# Altium schematic sheet M7_DSP_MCU_Power.SchDoc
size A3; SheetNumber: 2; SheetTotal: 5
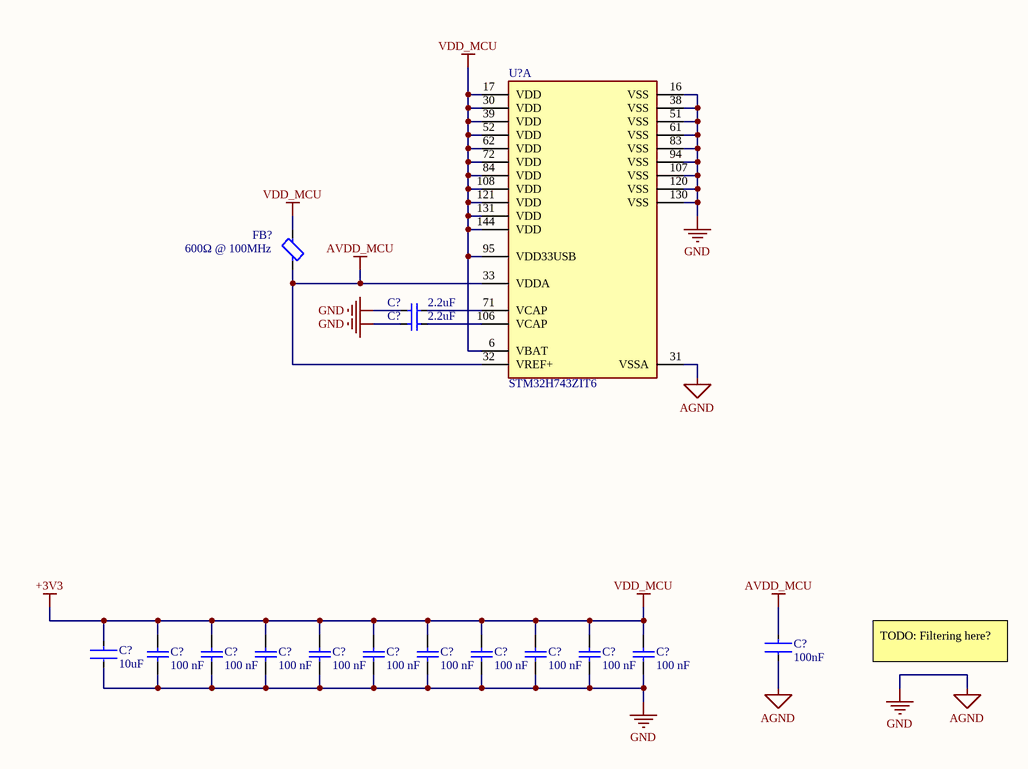
[diagram p0: M7_DSP_MCU_Power.SchDoc]

## Parts
(Parts that share a designator on the sheet are numbered #1, #2 ... from top to bottom, then left to right.)
C?#1  Capacitance: 2.2uF  [FP-CL10-IPC_A]  (hidden comment: CL10A225KO8NNNC)
C?#2  Capacitance: 2.2uF  [FP-CL10-IPC_A]  (hidden comment: CL10A225KO8NNNC)
C?#3  Capacitance: 100 nF  [CAPC1608X90X40ML10T20]  (hidden comment: CC0603ZRY5V9BB104)
C?#4  Capacitance: 100 nF  [CAPC1608X90X40ML10T20]  (hidden comment: CC0603ZRY5V9BB104)
C?#5  Capacitance: 100 nF  [CAPC1608X90X40ML10T20]  (hidden comment: CC0603ZRY5V9BB104)
C?#6  Capacitance: 100 nF  [CAPC1608X90X40ML10T20]  (hidden comment: CC0603ZRY5V9BB104)
C?#7  Capacitance: 100 nF  [CAPC1608X90X40ML10T20]  (hidden comment: CC0603ZRY5V9BB104)
C?#8  Capacitance: 100 nF  [CAPC1608X90X40ML10T20]  (hidden comment: CC0603ZRY5V9BB104)
C?#9  Capacitance: 100 nF  [CAPC1608X90X40ML10T20]  (hidden comment: CC0603ZRY5V9BB104)
C?#10  Capacitance: 100 nF  [CAPC1608X90X40ML10T20]  (hidden comment: CC0603ZRY5V9BB104)
C?#11  Capacitance: 100 nF  [CAPC1608X90X40ML10T20]  (hidden comment: CC0603ZRY5V9BB104)
C?#12  Capacitance: 100 nF  [CAPC1608X90X40ML10T20]  (hidden comment: CC0603ZRY5V9BB104)
C?#13  Capacitance: 100nF  [FP-0402-L_1_0_0_05-W_0_5-MFG]  (hidden comment: TMK105B7104MV-FR)
C?#14  value 10uF  [FP-GRM21B-0_2-e0_2_0_7-MFG]  (hidden comment: GRM21BC71E106ME11L)
FB?  MMZ1608B601CTAH0  [FP-MMZ1608-0_6-IPC_C]  (value not drawn)
U?  STM32H743ZIT6  [FP-LQFP144-1A-IPC_A]  (part A of 3)

## Nets
+3V3: C?#3.1 C?#4.1 C?#5.1 C?#6.1 C?#7.1 C?#8.1 C?#9.1 C?#10.1 C?#11.1 C?#12.1 C?#14.1 FB?.1 U?.6(VBAT) U?.17(VDD) U?.30(VDD) U?.39(VDD) U?.52(VDD) U?.62(VDD) U?.72(VDD) U?.84(VDD) U?.95(VDD33USB) U?.108(VDD) U?.121(VDD) U?.131(VDD) U?.144(VDD)  [also labelled VDD_MCU]
AGND: C?#1.2 C?#2.2 C?#3.2 C?#4.2 C?#5.2 C?#6.2 C?#7.2 C?#8.2 C?#9.2 C?#10.2 C?#11.2 C?#12.2 C?#13.2 C?#14.2 U?.16(VSS) U?.31(VSSA) U?.38(VSS) U?.51(VSS) U?.61(VSS) U?.83(VSS) U?.94(VSS) U?.107(VSS) U?.120(VSS) U?.130(VSS)  [also labelled GND]
AVDD_MCU: C?#13.1 FB?.2 U?.32(VREF+) U?.33(VDDA)
NetC?#1_1: C?#1.1 U?.71(VCAP)
NetC?#2_1: C?#2.1 U?.106(VCAP)

## Notes on the sheet
- (near FB?) 600Ω @ 100MHz
- TODO: Filtering here?

## Library data of the parts
C?#1 C?#2 = CMP-13271-000835-1: Cap Ceramic 2.2uF 16V X5R ±10% Pad SMD 0603 +85°C T/R; Case Code (Metric): 1608; Height: 0.8mm; Case/Package: 0603; Depth: 0.8mm; Voltage Rating: 16V; Case Code (Imperial): 0603; Length: 1.6mm; Packaging: Tape and Reel; Material: Ceramic; Lead Free: Lead Free; Max Operating Temperature: 85°C; Contact Plating: Tin; Thickness: 0.035inch; Radiation Hardening: No; Tolerance: 10%; Min Operating Temperature: -55°C; Voltage: 16V; Dielectric: X5R; Mount: Surface Mount; Package Quantity: 4000; Width: 0.031inch; Voltage Rating (DC): 16V; Supplier 1: Rs; Supplier Part Number 1: 7664799
C?#3-C?#12 = CMP-1035-02594-2: Chip Capacitor, 100 nF, - 20% to + 80%, 50 V, -30 to 85 degC, 0603 (1608 Metric), RoHS, Tape and Reel; Manufacturer: Yageo; Tolerance: -20%,+80%; Product Training Modules: MultilayerCeramicCapacitors; Temperature Coefficient: Y5V(F); Kits: CC060300000000000-ND-MLCC0603SAMPLEKIT; Other Names: 311-1343-1; Featured Product: CommodityMultilayerCeramicCapacitors–CCSeries; Online Catalog: CCSeries; Voltage - Rated: 50V; Mounting Type: SurfaceMount,MLCC; Package Description: 2-Pin Surface Mount Device, Body 1.6 x 0.8 mm; Ratings: -; Lead Spacing: -; Standard Package: 1; Applications: GeneralPurpose; Size / Dimension: 0.063"Lx0.031"W(1.60mmx0.80mm); Package Reference: 0603; Operating Temperature: -30°C~85°C; Features: -; Height - Seated (Max): -; Thickness (Max): 0.035"(0.90mm); Series: CC; Datasheet URL: https://datasheet.ciiva.com/17434/upy-gphc-y5v-6-3v-to-50v-5-17434523.pdf; Family: CeramicCapacitors; Mounting Technology: SurfaceMount; Packaging: CutTape(CT); Package / Case: 0603(1608Metric); Manufacturer URL: http://www.yageo.com/; Category: Capacitors; Lead Style: -; Datasheet Version: Rev. 5, 07/2010; Supplier 1: Rs; Supplier Part Number 1: 6169565
C?#13 = CMP-14477-003834-2: Multilayer Ceramic Capacitors (High dielectric type), 25V, 0.1 uF, ± 20 %, 0402, X7R, RoHS; Manufacturer: Taiyo Yuden; Tolerance: 20%; Value: 100nF; Min Operating Temperature: -55°C; Voltage Rating: 25V; Max Operating Temperature: 125°C; Mount: Surface Mount; RoHS Compliant: Yes; Case/Package: 0402; Packaging: Tape and Reel; Supplier 1: Avnet; Manufacturer Part Number: TMK105B7104MV-FR; RoHS: Yes; Category: Ceramic Capacitors; Stock 1: 20000; Pricing 1: 10000=0.00533, 20000=0.00524, 40000=0.00515, 60000=0.00506, 80000=0.00497 (USD); Mounting Technology: Surface Mount; Series: M; ComponentLink1URL: http://ds.yuden.co.jp/TYCOMPAS/ut/detail.do?productNo=TMK105B7104MV-FR&amp;fileName=TMK105B7104MV-FR_SS&amp;mode=specSheetDownload&src-supplier=Digikey; ComponentLink1Description: http://ds.yuden.co.jp/TYCOMPAS/ut/detail.do?productNo=TMK105B7104MV-FR&amp;fileName=TMK105B7104MV-FR_SS&amp;mode=specSheetDownload&src-supplier=Digikey; Supplier Part Number 1: TMK105B7104MV-FR
C?#14 = GRM21BC71E106ME11L: Multilayer Ceramic Capacitors MLCC - SMD/SMT 0805 10uF 25volts *Derate Voltage/Temp; Manufacturer: Murata; Voltage Rating: 25V; Tolerance: 20%; Dielectric: X7S; Manufacturer Part Number: GRM21BC71E106ME11L; RoHS: Yes; Category: Ceramic Capacitors; Stock 1: 6000; Pricing 1: 3000=0.1097, 9000=0.0994, 24000=0.097, 45000=0.0923 (USD); Mounting Technology: Surface Mount; Case/Package: 0805; Case Code (Metric): 2012; Case Code (Imperial): 0805; Weight: 0.000335oz; Min Operating Temperature: -55°C; Max Operating Temperature: 125°C; Packaging: Tape and Reel; Termination: SMD/SMT; Voltage Rating (DC): 25V; Package Quantity: 3000; Series: GRM; Length: 0.079inch; Width: 0.049inch; Height: 1.25mm; Thickness: 0.057inch; RoHS Compliant: Yes; ComponentLink1URL: http://www.mouser.com/ds/2/281/c02e-2905.pdf?src-supplier=Mouser; ComponentLink1Description: http://www.mouser.com/ds/2/281/c02e-2905.pdf?src-supplier=Mouser; ComponentLink2URL: http://search.murata.co.jp/Ceramy/image/img/A01X/G101/ENG/GRM21BC71E106ME11-01.pdf?src-supplier=Digikey; ComponentLink2Description: http://search.murata.co.jp/Ceramy/image/img/A01X/G101/ENG/GRM21BC71E106ME11-01.pdf?src-supplier=Digikey; ComponentLink3URL: http://search.murata.co.jp/Ceramy/image/img/A01X/partnumbering_e_01.pdf?src-supplier=Digikey; ComponentLink3Description: http://search.murata.co.jp/Ceramy/image/img/A01X/partnumbering_e_01.pdf?src-supplier=Digikey; ComponentLink4URL: https://datasheet.octopart.com/GRM21BC71E106ME11L-Murata-datasheet-149523451.pdf?src-supplier=Newark; ComponentLink4Description: https://datasheet.octopart.com/GRM21BC71E106ME11L-Murata-datasheet-149523451.pdf?src-supplier=Newark; ComponentLink5URL: https://datasheet.octopart.com/GRM21BC71E106ME11L-Murata-datasheet-32479577.pdf?src-supplier=Future+Electronics; ComponentLink5Description: https://datasheet.octopart.com/GRM21BC71E106ME11L-Murata-datasheet-32479577.pdf?src-supplier=Future+Electronics; Supplier Part Number 1: GRM21BC71E106ME11L; Supplier 1: Arrow Electronics
FB? = CMP-08257-000106-1: Signal Line Ferrite Bead 600 Ω 100MHz 500mA DCR 400mΩ SMD 0603; Tolerance: 25%; Impedance: 600R; DC Resistance (DCR): 400mR; Packaging: Cut Tape; Depth: 0.8mm; Case Code (Metric): 1608; Mount: Surface Mount; REACH SVHC: No SVHC; Case/Package: 0603; Max DC Current: 500mA; Height: 0.03inch; Case Code (Imperial): 0603; Package Quantity: 1; RoHS Compliant: Yes; Core Material: Ferrite; Length: 0.063inch; Current Rating: 500mA; Width: 0.031inch; Supplier 1: Rs; Supplier Part Number 1: 7865015
U? = CMP-12105-000003-1: IC MCU 32BIT 2MB FLASH 144LQFP; Manufacturer: STMicroelectronics; Number Of I2C Channels: 4; Number Of A/D Converters: 2; Standoff Height: 0.05mm; Interface: I2C,SPI,UART,USART,EBI/EMI,CAN,USB,LIN,IrDA,Other; Max Supply Voltage: 3.6V; Number Of Adc Channels: 36; Ram Size: 1MBytes; Number Of Cores: 1; Frequency: 400MHz; Data Bus Width: 32bits; Core Architecture: ARM Cortex-M7; Memory Size: 2MBytes; Number Of Timers/Counters: 22; Min Supply Voltage: 1.62V; Number Of Spi Channels: 6; Max Junction Temp: +125°C; Number Of I/Os: 114; Digikey Description: IC MCU 32BIT 2MB FLASH 144LQFP; Device Class L2: Embedded Processors and Controllers; Number Of Usb Channels: 2; ComponentLink2Description: Datasheet; Ipc Land Pattern Name: QFP50P2200X2200X160-144; Category: IC; Lead Free: Yes; Temperature Range High: +85°C; Mouser Description: MCU 32-Bit STM32 ARM Cortex M7 RISC 2MB Flash 1.8V/2.5V/3.3V 144-Pin LQFP Tray; RoHS: TRUE; Ambient Temperature Range Low: -40°C; Temperature Range Low: -40°C; ComponentLink2URL: https://www.st.com/resource/en/datasheet/stm32h743zi.pdf; Ambient Temperature Range High: +85°C; Octopart: https://octopart.com/stm32h743zit6-stmicroelectronics-76372529; Number Of Pwm Channels: 2; Height: 1.6mm; Manufacturer Part Number: STM32H743ZIT6; Device Class L3: Microcontrollers; Device Class L1: Integrated Circuits (ICs); Automotive: No; Memory Type: FLASH; Number Of Uart Channels: 4; Package: LQFP144-1A; Temperature: -40°C to +85°C; Supplier 1: Mouser; Supplier Part Number 1: 511-STM32H743ZIT6